# Altium project XC Tail Light Driver.PrjPcb
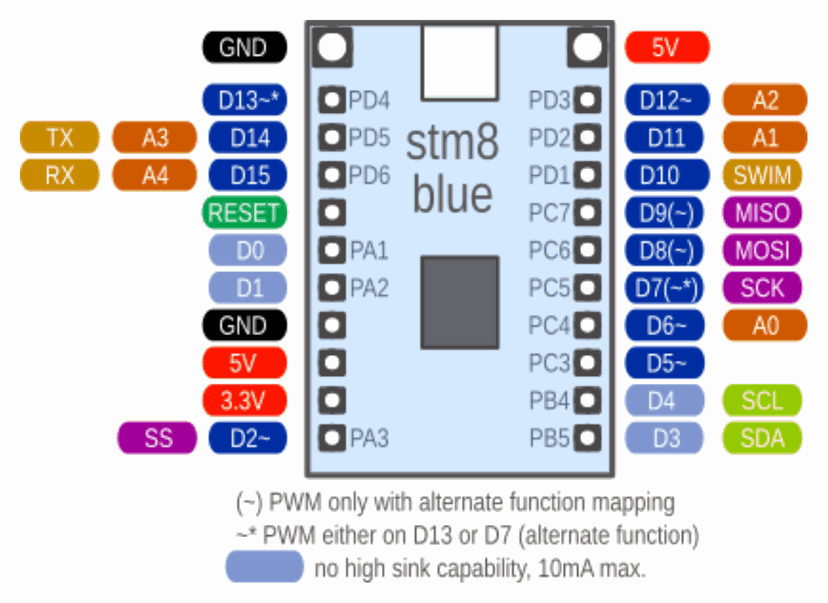
[diagram p0: XC STM8.SchDoc]
7 sheets, 103 parts. Net scope: global (net labels, ports and power ports of the same name join across sheets).
Board file: XC Driver Board.PcbDoc
Sheets:
  XC STM8.SchDoc
  XC Tail Light Driver.SchDoc
  PWM Drivers.SchDoc
  Power Supplies.SchDoc
  Signals.SchDoc
  ESP-WROOM-32 38 PIN Develeopment Board PINOUT.SchDoc
  ESP32.SchDoc

## Sheet XC STM8.SchDoc
size A4

## Sheet XC Tail Light Driver.SchDoc
size A4
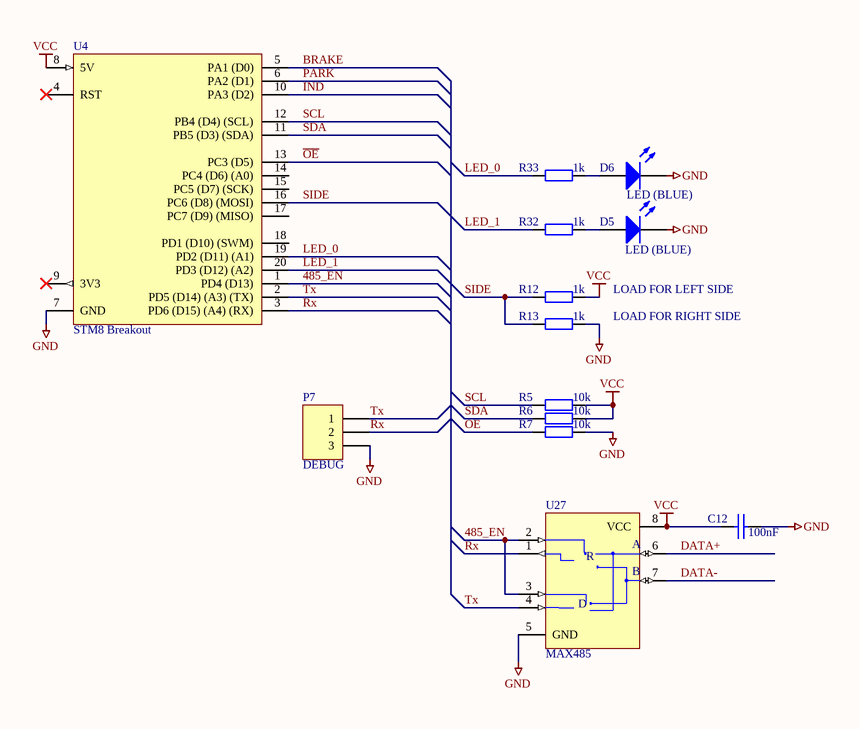
[diagram p1: XC Tail Light Driver.SchDoc]

### Parts
C12  100nF  [CAPACITOR 0805]
D5  LED (BLUE)  [LED(3D) 3MM VERTICAL (GREEN)]
D6  LED (BLUE)  [LED(3D) 3MM VERTICAL (GREEN)]
P7  DEBUG  [Pin Header 1x3 TH Pitch 2.54mm]
R5  10k  [RESISTOR 0805]
R6  10k  [RESISTOR 0805]
R7  10k  [RESISTOR 0805]
R12  1k  [RESISTOR 0805]
R13  1k  [RESISTOR 0805]
R32  1k  [RESISTOR 0805]
R33  1k  [RESISTOR 0805]
U4  STM8 Breakout  [STM8 Breakout]
U27  MAX485  [SO-8]

### Nets
GND: C12.2 D5.2(K) D6.2(K) P7.3 R7.1 R13.1 U4.7(GND) U27.5(GND)
VCC: C12.1 R5.1 R6.1 R12.1 U4.8(5V) U27.8(VCC)
485_EN: U4.1(PD4_(D13)) U27.2(~{RE}) U27.3(DE)
BRAKE: U4.5(PA1_(D0))
DATA+: U27.6(A)
DATA-: U27.7(B)
IND: U4.10(PA3_(D2))
LED_0: R33.2 U4.19(PD2_(D11)_(A1))
LED_1: R32.2 U4.20(PD3_(D12)_(A2))
~{OE}: R7.2 U4.13(PC3_(D5))
PARK: U4.6(PA2_(D1))
Rx: P7.2 U4.3(PD6_(D15)_(A4)_(RX)) U27.1(RO)
SCL: R5.2 U4.12(PB4_(D4)_(SCL))
SDA: R6.2 U4.11(PB5_(D3)_(SDA))
SIDE: R12.2 R13.2 U4.16(PC6_(D8)_(MOSI))
Tx: P7.1 U4.2(PD5_(D14)_(A3)_(TX)) U27.4(DI)
NetD5_1: D5.1(A) R32.1
NetD6_1: D6.1(A) R33.1

Not connected (* = marked no-connect by the designer): U4 4(RST)* 9(3V3)* 14(PC4_(D6)_(A0)) 15(PC5_(D7)_(SCK)) 17(PC7_(D9)_(MISO)) 18(PD1_(D10)_(SWM))

### Notes on the sheet
- LOAD FOR LEFT SIDE
- LOAD FOR RIGHT SIDE
- (in symbol MAX487CPA) R; D

### Library data of the parts
C12 = CAP: CAPACITOR SMD 0603; Manufacturer: Murata; Manufacturer Part No.: GCM188R71C104KA37D; value: 100nF; Mouser Part no.: 81-GCM188R71C104KA7D; Web link: http://au.mouser.com/ProductDetail/Murata/GCM188R71C104KA37D/?qs=aEuGZpxfbxWKAxwYn%252beTMg%3d%3d
D5 D6 = LED 3mm RED: 3mm RED LED; Manufacturer: Kingbright; Manufacturer Part No.: WP132XIT; Mouser Part no.: 604-WP132XIT; Farnell Part no.: 1003393; Web link: http://au.mouser.com/Search/Refine.aspx?Keyword=604-WP132XIT
P7 = Header 3: Header, 3 Pin; Manufacturer: FCI; Manufacturer Part No.: 68020-102; Mouser Part no.: 649-68020-102; Web link: http://au.mouser.com/ProductDetail/FCI/68020-102/?qs=sGAEpiMZZMs%252bGHln7q6pm44kDepmYTI87r6%2fnQtKGLI%3d
R5-R7 R12 R13 R32 R33 = Res2: Resistor; Published: 8-Jun-2000; LatestRevisionDate: 17-Jul-2002; LatestRevisionNote: Re-released for DXP Platform.; PackageReference: AXIAL-0.4; Publisher: Altium Limited; PackageDescription: Axial Device, Thru-Hole; 2 Leads; 0.4 in Pin Spacing
  R5-R7: Value: 10k
  R12 R13 R32 R33: Value: 1k
U27 = MAX487CPA: MAX485 485/422 Transceiver; LCSC Part Number: C9945

## Sheet PWM Drivers.SchDoc
size A3
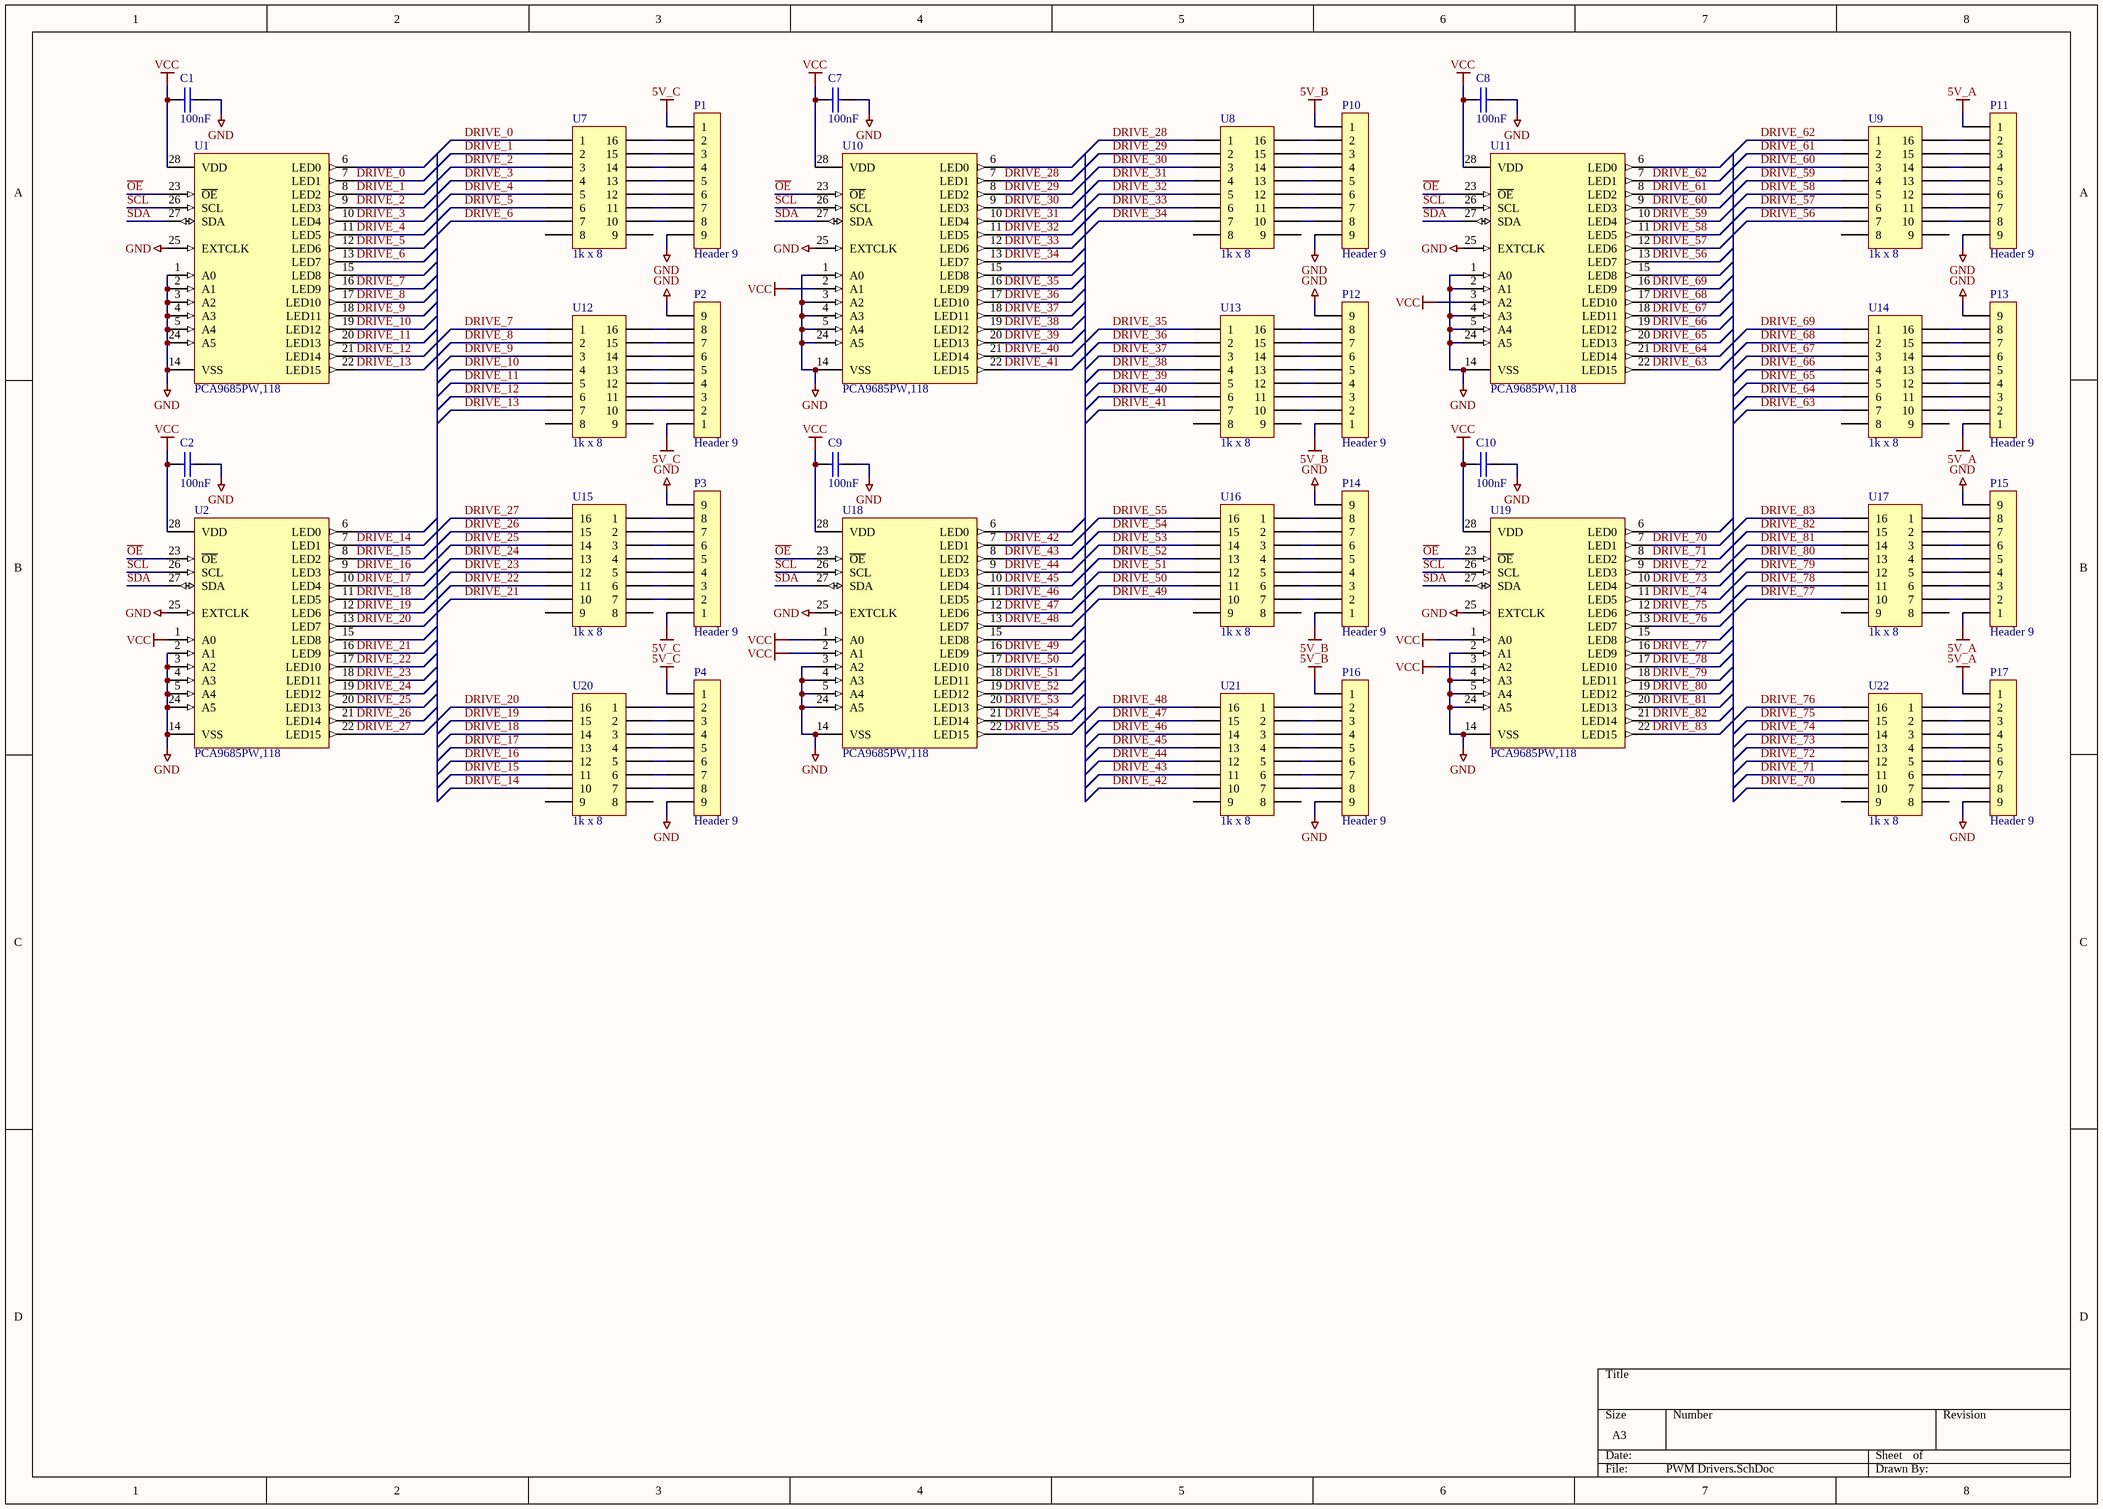
[diagram p2: PWM Drivers.SchDoc]

### Parts
C1  100nF  [CAPACITOR 0805]
C2  100nF  [CAPACITOR 0805]
C7  100nF  [CAPACITOR 0805]
C8  100nF  [CAPACITOR 0805]
C9  100nF  [CAPACITOR 0805]
C10  100nF  [CAPACITOR 0805]
P1  Header 9  [SOCKET 1x9]
P2  Header 9  [SOCKET 1x9]
P3  Header 9  [SOCKET 1x9]
P4  Header 9  [SOCKET 1x9]
P10  Header 9  [SOCKET 1x9]
P11  Header 9  [SOCKET 1x9]
P12  Header 9  [SOCKET 1x9]
P13  Header 9  [SOCKET 1x9]
P14  Header 9  [SOCKET 1x9]
P15  Header 9  [SOCKET 1x9]
P16  Header 9  [SOCKET 1x9]
P17  Header 9  [SOCKET 1x9]
U1  PCA9685PW,118  [SSOP28]
U2  PCA9685PW,118  [SSOP28]
U7  1k x 8  [DIP 16]
U8  1k x 8  [DIP 16]
U9  1k x 8  [DIP 16]
U10  PCA9685PW,118  [SSOP28]
U11  PCA9685PW,118  [SSOP28]
U12  1k x 8  [DIP 16]
U13  1k x 8  [DIP 16]
U14  1k x 8  [DIP 16]
U15  1k x 8  [DIP 16]
U16  1k x 8  [DIP 16]
U17  1k x 8  [DIP 16]
U18  PCA9685PW,118  [SSOP28]
U19  PCA9685PW,118  [SSOP28]
U20  1k x 8  [DIP 16]
U21  1k x 8  [DIP 16]
U22  1k x 8  [DIP 16]

### Nets
5V_A: P11.1 P13.1 P15.1 P17.1
5V_B: P10.1 P12.1 P14.1 P16.1
5V_C: P1.1 P2.1 P3.1 P4.1
GND: C1.2 C2.2 C7.2 C8.2 C9.2 C10.2 P1.9 P2.9 P3.9 P4.9 P10.9 P11.9 P12.9 P13.9 P14.9 P15.9 P16.9 P17.9 U1.1(A0) U1.2(A1) U1.3(A2) U1.4(A3) U1.5(A4) U1.14(VSS) U1.24(A5) U1.25(EXTCLK) U2.2(A1) U2.3(A2) U2.4(A3) U2.5(A4) U2.14(VSS) U2.24(A5) U2.25(EXTCLK) U10.1(A0) U10.3(A2) U10.4(A3) U10.5(A4) U10.14(VSS) U10.24(A5) U10.25(EXTCLK) U11.1(A0) U11.2(A1) U11.4(A3) U11.5(A4) U11.14(VSS) U11.24(A5) U11.25(EXTCLK) U18.3(A2) U18.4(A3) U18.5(A4) U18.14(VSS) U18.24(A5) U18.25(EXTCLK) U19.2(A1) U19.4(A3) U19.5(A4) U19.14(VSS) U19.24(A5) U19.25(EXTCLK)
VCC: C1.1 C2.1 C7.1 C8.1 C9.1 C10.1 U1.28(VDD) U2.1(A0) U2.28(VDD) U10.2(A1) U10.28(VDD) U11.3(A2) U11.28(VDD) U18.1(A0) U18.2(A1) U18.28(VDD) U19.1(A0) U19.3(A2) U19.28(VDD)
DRIVE_0: U1.7(LED1) U7.1
DRIVE_1: U1.8(LED2) U7.2
DRIVE_2: U1.9(LED3) U7.3
DRIVE_3: U1.10(LED4) U7.4
DRIVE_4: U1.11(LED5) U7.5
DRIVE_5: U1.12(LED6) U7.6
DRIVE_6: U1.13(LED7) U7.7
DRIVE_7: U1.16(LED9) U12.1
DRIVE_8: U1.17(LED10) U12.2
DRIVE_9: U1.18(LED11) U12.3
DRIVE_10: U1.19(LED12) U12.4
DRIVE_11: U1.20(LED13) U12.5
DRIVE_12: U1.21(LED14) U12.6
DRIVE_13: U1.22(LED15) U12.7
DRIVE_14: U2.7(LED1) U20.10
DRIVE_15: U2.8(LED2) U20.11
DRIVE_16: U2.9(LED3) U20.12
DRIVE_17: U2.10(LED4) U20.13
DRIVE_18: U2.11(LED5) U20.14
DRIVE_19: U2.12(LED6) U20.15
DRIVE_20: U2.13(LED7) U20.16
DRIVE_21: U2.16(LED9) U15.10
DRIVE_22: U2.17(LED10) U15.11
DRIVE_23: U2.18(LED11) U15.12
DRIVE_24: U2.19(LED12) U15.13
DRIVE_25: U2.20(LED13) U15.14
DRIVE_26: U2.21(LED14) U15.15
DRIVE_27: U2.22(LED15) U15.16
DRIVE_28: U8.1 U10.7(LED1)
DRIVE_29: U8.2 U10.8(LED2)
DRIVE_30: U8.3 U10.9(LED3)
DRIVE_31: U8.4 U10.10(LED4)
DRIVE_32: U8.5 U10.11(LED5)
DRIVE_33: U8.6 U10.12(LED6)
DRIVE_34: U8.7 U10.13(LED7)
DRIVE_35: U10.16(LED9) U13.1
DRIVE_36: U10.17(LED10) U13.2
DRIVE_37: U10.18(LED11) U13.3
DRIVE_38: U10.19(LED12) U13.4
DRIVE_39: U10.20(LED13) U13.5
DRIVE_40: U10.21(LED14) U13.6
DRIVE_41: U10.22(LED15) U13.7
DRIVE_42: U18.7(LED1) U21.10
DRIVE_43: U18.8(LED2) U21.11
DRIVE_44: U18.9(LED3) U21.12
DRIVE_45: U18.10(LED4) U21.13
DRIVE_46: U18.11(LED5) U21.14
DRIVE_47: U18.12(LED6) U21.15
DRIVE_48: U18.13(LED7) U21.16
DRIVE_49: U16.10 U18.16(LED9)
DRIVE_50: U16.11 U18.17(LED10)
DRIVE_51: U16.12 U18.18(LED11)
DRIVE_52: U16.13 U18.19(LED12)
DRIVE_53: U16.14 U18.20(LED13)
DRIVE_54: U16.15 U18.21(LED14)
DRIVE_55: U16.16 U18.22(LED15)
DRIVE_56: U9.7 U11.13(LED7)
DRIVE_57: U9.6 U11.12(LED6)
DRIVE_58: U9.5 U11.11(LED5)
DRIVE_59: U9.4 U11.10(LED4)
DRIVE_60: U9.3 U11.9(LED3)
DRIVE_61: U9.2 U11.8(LED2)
DRIVE_62: U9.1 U11.7(LED1)
DRIVE_63: U11.22(LED15) U14.7
DRIVE_64: U11.21(LED14) U14.6
DRIVE_65: U11.20(LED13) U14.5
DRIVE_66: U11.19(LED12) U14.4
DRIVE_67: U11.18(LED11) U14.3
DRIVE_68: U11.17(LED10) U14.2
DRIVE_69: U11.16(LED9) U14.1
DRIVE_70: U19.7(LED1) U22.10
DRIVE_71: U19.8(LED2) U22.11
DRIVE_72: U19.9(LED3) U22.12
DRIVE_73: U19.10(LED4) U22.13
DRIVE_74: U19.11(LED5) U22.14
DRIVE_75: U19.12(LED6) U22.15
DRIVE_76: U19.13(LED7) U22.16
DRIVE_77: U17.10 U19.16(LED9)
DRIVE_78: U17.11 U19.17(LED10)
DRIVE_79: U17.12 U19.18(LED11)
DRIVE_80: U17.13 U19.19(LED12)
DRIVE_81: U17.14 U19.20(LED13)
DRIVE_82: U17.15 U19.21(LED14)
DRIVE_83: U17.16 U19.22(LED15)
~{OE}: U1.23(~{OE}) U2.23(~{OE}) U10.23(~{OE}) U11.23(~{OE}) U18.23(~{OE}) U19.23(~{OE})
SCL: U1.26(SCL) U2.26(SCL) U10.26(SCL) U11.26(SCL) U18.26(SCL) U19.26(SCL)
SDA: U1.27(SDA) U2.27(SDA) U10.27(SDA) U11.27(SDA) U18.27(SDA) U19.27(SDA)
NetP1_2: P1.2 U7.16
NetP1_3: P1.3 U7.15
NetP1_4: P1.4 U7.14
NetP1_5: P1.5 U7.13
NetP1_6: P1.6 U7.12
NetP1_7: P1.7 U7.11
NetP1_8: P1.8 U7.10
NetP2_2: P2.2 U12.10
NetP2_3: P2.3 U12.11
NetP2_4: P2.4 U12.12
NetP2_5: P2.5 U12.13
NetP2_6: P2.6 U12.14
NetP2_7: P2.7 U12.15
NetP2_8: P2.8 U12.16
NetP3_2: P3.2 U15.7
NetP3_3: P3.3 U15.6
NetP3_4: P3.4 U15.5
NetP3_5: P3.5 U15.4
NetP3_6: P3.6 U15.3
NetP3_7: P3.7 U15.2
NetP3_8: P3.8 U15.1
NetP4_2: P4.2 U20.1
NetP4_3: P4.3 U20.2
NetP4_4: P4.4 U20.3
NetP4_5: P4.5 U20.4
NetP4_6: P4.6 U20.5
NetP4_7: P4.7 U20.6
NetP4_8: P4.8 U20.7
NetP10_2: P10.2 U8.16
NetP10_3: P10.3 U8.15
NetP10_4: P10.4 U8.14
NetP10_5: P10.5 U8.13
NetP10_6: P10.6 U8.12
NetP10_7: P10.7 U8.11
NetP10_8: P10.8 U8.10
NetP11_2: P11.2 U9.16
NetP11_3: P11.3 U9.15
NetP11_4: P11.4 U9.14
NetP11_5: P11.5 U9.13
NetP11_6: P11.6 U9.12
NetP11_7: P11.7 U9.11
NetP11_8: P11.8 U9.10
NetP12_2: P12.2 U13.10
NetP12_3: P12.3 U13.11
NetP12_4: P12.4 U13.12
NetP12_5: P12.5 U13.13
NetP12_6: P12.6 U13.14
NetP12_7: P12.7 U13.15
NetP12_8: P12.8 U13.16
NetP13_2: P13.2 U14.10
NetP13_3: P13.3 U14.11
NetP13_4: P13.4 U14.12
NetP13_5: P13.5 U14.13
NetP13_6: P13.6 U14.14
NetP13_7: P13.7 U14.15
NetP13_8: P13.8 U14.16
NetP14_2: P14.2 U16.7
NetP14_3: P14.3 U16.6
NetP14_4: P14.4 U16.5
NetP14_5: P14.5 U16.4
NetP14_6: P14.6 U16.3
NetP14_7: P14.7 U16.2
NetP14_8: P14.8 U16.1
NetP15_2: P15.2 U17.7
NetP15_3: P15.3 U17.6
NetP15_4: P15.4 U17.5
NetP15_5: P15.5 U17.4
NetP15_6: P15.6 U17.3
NetP15_7: P15.7 U17.2
NetP15_8: P15.8 U17.1
NetP16_2: P16.2 U21.1
NetP16_3: P16.3 U21.2
NetP16_4: P16.4 U21.3
NetP16_5: P16.5 U21.4
NetP16_6: P16.6 U21.5
NetP16_7: P16.7 U21.6
NetP16_8: P16.8 U21.7
NetP17_2: P17.2 U22.1
NetP17_3: P17.3 U22.2
NetP17_4: P17.4 U22.3
NetP17_5: P17.5 U22.4
NetP17_6: P17.6 U22.5
NetP17_7: P17.7 U22.6
NetP17_8: P17.8 U22.7

Not connected (* = marked no-connect by the designer): U1 6(LED0) 15(LED8); U2 6(LED0) 15(LED8); U7 8 9; U8 8 9; U9 8 9; U10 6(LED0) 15(LED8); U11 6(LED0) 15(LED8); U12 8 9; U13 8 9; U14 8 9; U15 8 9; U16 8 9; U17 8 9; U18 6(LED0) 15(LED8); U19 6(LED0) 15(LED8); U20 8 9; U21 8 9; U22 8 9

### Library data of the parts
C1 C2 C7-C10 = CAP: as C12 on sheet XC Tail Light Driver; value: 100nF; Mouser Part no.: 81-GCM188R71C104KA7D; Web link: http://au.mouser.com/ProductDetail/Murata/GCM188R71C104KA37D/?qs=aEuGZpxfbxWKAxwYn%252beTMg%3d%3d
P1-P4 P10-P17 = Header 9: Header, 9-Pin; LatestRevisionDate: 17-Jul-2002; LatestRevisionNote: Re-released for DXP Platform.; Publisher: Altium Limited
U1 U2 U10 U11 U18 U19 = PCA9685PW,118: LED Driver IC 16 Output Linear PWM Dimming 25mA 28-TSSOP; MF: NXP USA; Package: TSSOP-28 NXP Semiconductors; MP: PCA9685PW,118; Value: *; SnapEDA_Link: https://www.snapeda.com/parts/PCA9685PW%2C118/NXP%20USA%20Inc./view-part/1041520/?ref=snap; Digi-Key_Purchase_URL: https://www.digikey.in/product-detail/en/nxp-usa-inc/PCA9685PW,118/568-11925-1-ND/5221902?utm_source=snapeda&utm_medium=aggregator&utm_campaign=symbol; Digi-Key_Part_Number: 568-11925-1-ND
U7-U9 U12-U17 U20-U22 = ResistorArray: DIP 16 Resistor Array 8 x 1k; Value: 1k x 8; LCSC Part Number: C1525823

## Sheet Power Supplies.SchDoc
size A4
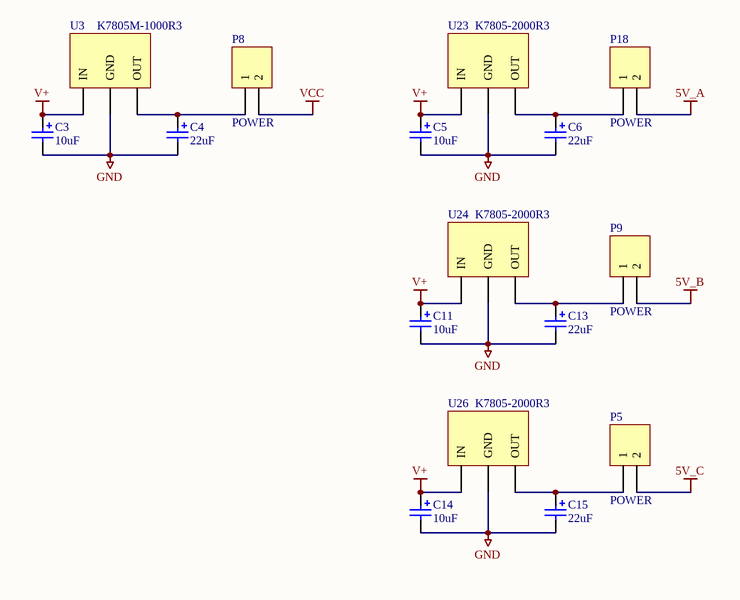
[diagram p3: Power Supplies.SchDoc]

### Parts
C3  10uF  [CAPACITOR 6.3x7]
C4  22uF  [CAPACITOR 5x11]
C5  10uF  [CAPACITOR 6.3x7]
C6  22uF  [CAPACITOR 5x11]
C11  10uF  [CAPACITOR 6.3x7]
C13  22uF  [CAPACITOR 5x11]
C14  10uF  [CAPACITOR 6.3x7]
C15  22uF  [CAPACITOR 5x11]
P5  POWER  [HEADER 1x2]
P8  POWER  [HEADER 1x2]
P9  POWER  [HEADER 1x2]
P18  POWER  [HEADER 1x2]
U3  K7805M-1000R3  [K78xxM-1000R3]
U23  K7805-2000R3  [K78xxM-1000R3L]
U24  K7805-2000R3  [K78xxM-1000R3L]
U26  K7805-2000R3  [K78xxM-1000R3L]

### Nets
5V_A: P18.2
5V_B: P9.2
5V_C: P5.2
GND: C3.2 C4.2 C5.2 C6.2 C11.2 C13.2 C14.2 C15.2 U3.2(GND) U23.2(GND) U24.2(GND) U26.2(GND)
V+: C3.1 C5.1 C11.1 C14.1 U3.1(IN) U23.1(IN) U24.1(IN) U26.1(IN)
VCC: P8.2
NetC4_1: C4.1 P8.1 U3.3(OUT)
NetC6_1: C6.1 P18.1 U23.3(OUT)
NetC13_1: C13.1 P9.1 U24.3(OUT)
NetC15_1: C15.1 P5.1 U26.3(OUT)

### Library data of the parts
C3-C6 C11 C13-C15 = Aluminum 10Dx16Hx5P: Polarized Capacitor (Radial)
  C3 C5 C11 C14: LCSC Part Number: C160183; Value: 10uF
  C4 C6 C13 C15: LCSC Part Number: C512951; Value: 22uF
P5 P8 P9 P18 = Header 2: Header, 2-Pin; LatestRevisionDate: 17-Jul-2002; LatestRevisionNote: Re-released for DXP Platform.; Publisher: Altium Limited
U3 = TRACO 1-2450: RS_PRO K7805M-1000R3; Value: K7805M-1000R3; Supplier: RS-COMPONENTS; Supplier Part Number: 193-4004
U23 U24 U26 = TRACO 1-2450: RS_PRO K7805-2000R3L; Value: K7805-2000R3; Supplier: RS-COMPONENTS; Supplier Part Number: 193-4032

## Sheet Signals.SchDoc
size A4
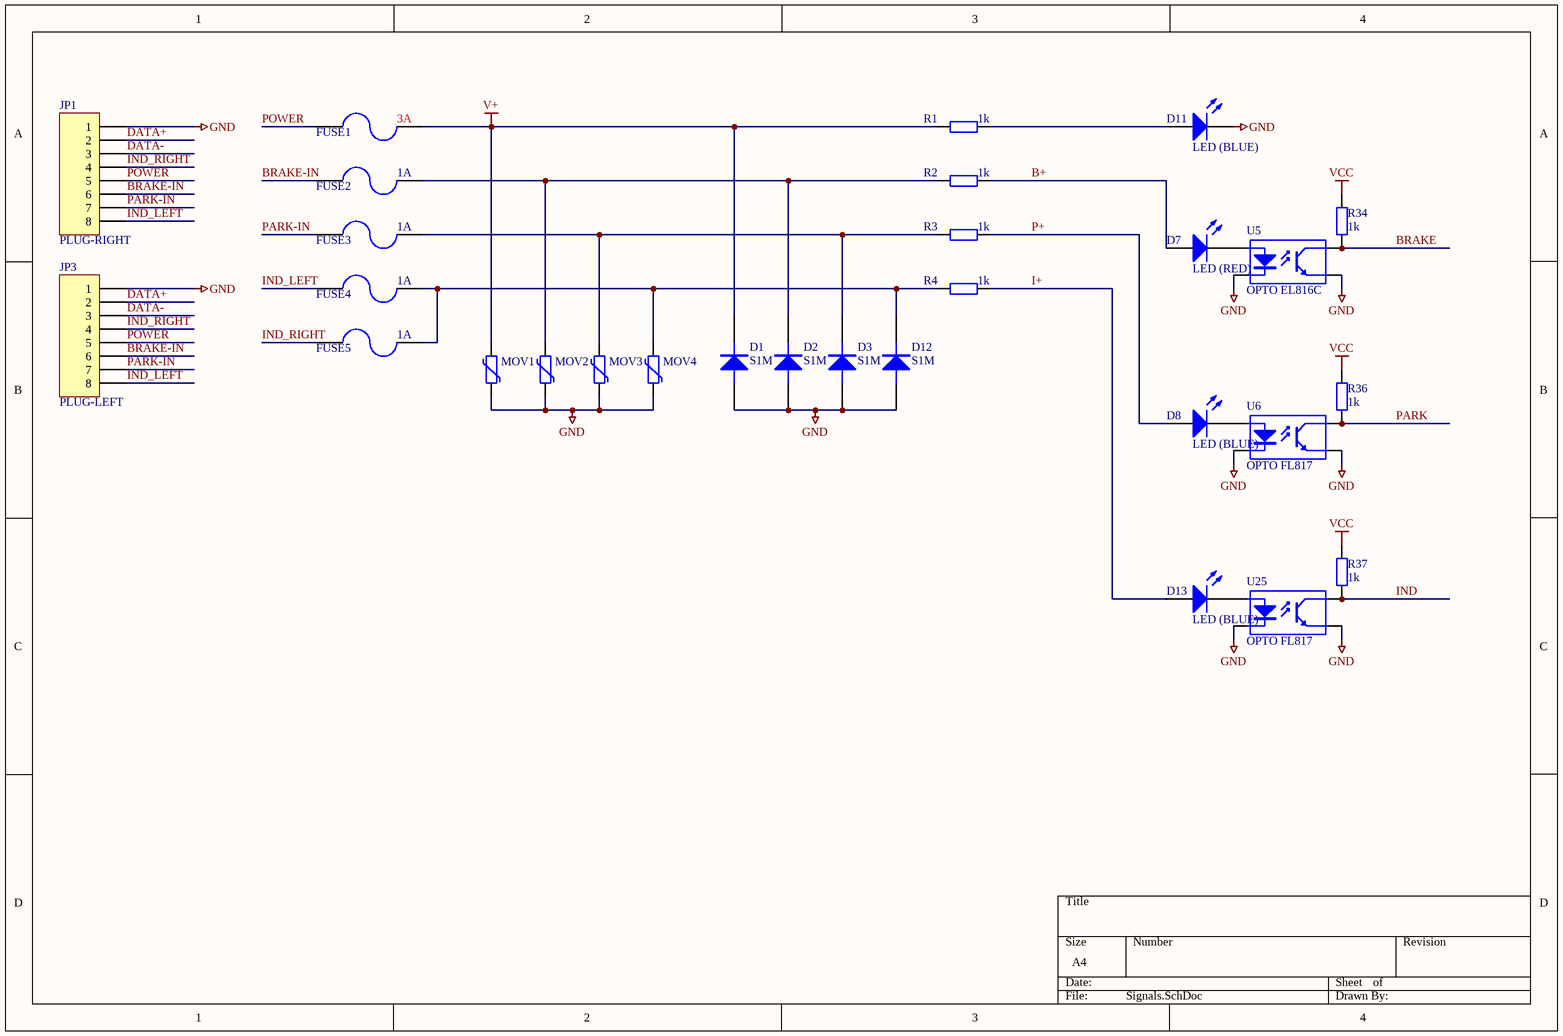
[diagram p4: Signals.SchDoc]

### Parts
D1  S1M  [DO-214AC]
D2  S1M  [DO-214AC]
D3  S1M  [DO-214AC]
D7  LED (RED)  [LED(3D) 3MM VERTICAL (GREEN)]
D8  LED (BLUE)  [LED(3D) 3MM VERTICAL (GREEN)]
D11  LED (BLUE)  [LED(3D) 3MM VERTICAL (GREEN)]
D12  S1M  [DO-214AC]
D13  LED (BLUE)  [LED(3D) 3MM VERTICAL (GREEN)]
FUSE1  3A  [miniSMD Polyswitch]
FUSE2  1A  [miniSMD Polyswitch]
FUSE3  1A  [miniSMD Polyswitch]
FUSE4  1A  [miniSMD Polyswitch]
FUSE5  1A  [miniSMD Polyswitch]
JP1  PLUG-RIGHT  [Molex 26013144 RA 8P Socket]
JP3  PLUG-LEFT  [Molex 26013144 RA 8P Socket]
MOV1  FTR FTR07D270K 22V  [MOV - 10mm]  (value not drawn)
MOV2  FTR FTR07D270K 22V  [MOV - 10mm]  (value not drawn)
MOV3  FTR FTR07D270K 22V  [MOV - 10mm]  (value not drawn)
MOV4  FTR FTR07D270K 22V  [MOV - 10mm]  (value not drawn)
R1  1k  [RESISTOR 0805]
R2  1k  [RESISTOR 0805]
R3  1k  [RESISTOR 0805]
R4  1k  [RESISTOR 0805]
R34  1k  [RESISTOR 0805]
R36  1k  [RESISTOR 0805]
R37  1k  [RESISTOR 0805]
U5  OPTO EL816C  [DIP_4]
U6  OPTO FL817  [DIP_4]
U25  OPTO FL817  [DIP_4]

### Nets
GND: D1.1(A) D2.1(A) D3.1(A) D11.2(K) D12.1(A) JP1.1 JP3.1 MOV1.2 MOV2.2 MOV3.2 MOV4.2 U5.2(K) U5.3(E) U6.2(K) U6.3(E) U25.2(K) U25.3(E)
V+: D1.2(K) FUSE1.2 MOV1.1 R1.2
VCC: R34.1 R36.1 R37.1
B+: D7.1(A) R2.1
BRAKE: R34.2 U5.4(C)
BRAKE-IN: FUSE2.1 JP1.6 JP3.6
DATA+: JP1.2 JP3.2
DATA-: JP1.3 JP3.3
I+: D13.1(A) R4.1
IND: R37.2 U25.4(C)
IND_LEFT: FUSE4.1 JP1.8 JP3.8
IND_RIGHT: FUSE5.1 JP1.4 JP3.4
P+: D8.1(A) R3.1
PARK: R36.2 U6.4(C)
PARK-IN: FUSE3.1 JP1.7 JP3.7
POWER: FUSE1.1 JP1.5 JP3.5
NetD2_2: D2.2(K) FUSE2.2 MOV2.1 R2.2
NetD3_2: D3.2(K) FUSE3.2 MOV3.1 R3.2
NetD7_2: D7.2(K) U5.1(A)
NetD8_2: D8.2(K) U6.1(A)
NetD11_1: D11.1(A) R1.1
NetD12_2: D12.2(K) FUSE4.2 FUSE5.2 MOV4.1 R4.2
NetD13_2: D13.2(K) U25.1(A)

### Library data of the parts
D1-D3 D12 = DIODE: DIODE, POWER; Manufacturer: Taiwan Semiconductor; Mouser Part no.: 821-S1M; Manufacturer Part No.: S1M; value: S1M; Web link: http://au.mouser.com/ProductDetail/Taiwan-Semiconductor/S1M/?qs=sGAEpiMZZMtEwUVCuofpuOlSmRjzJonf%252bmrIm0%252bGbjE%3d
D7 D8 D11 D13 = LED 3mm RED: as D5 on sheet XC Tail Light Driver; Mouser Part no.: 604-WP132XIT; Farnell Part no.: 1003393; Web link: http://au.mouser.com/Search/Refine.aspx?Keyword=604-WP132XIT
FUSE1-FUSE5 = POLYSWITCH 500mA: POLYSWITCH 1A; Manufacturer: Tyco Electronics / Raychem; Manufacturer Part No.: MINISMDC050F-2; Mouser Part no.: 650-MINISMDC050F-2; Farnell Part no.: 1175839; Web link: http://au.mouser.com/ProductDetail/Tyco-Electronics-Raychem/MINISMDC050F-2/?qs=sGAEpiMZZMu7EFbsM1w0neRfX3mrvYIvOpkrchiUGng%3d
JP1 JP3 = Header 8: HEADER, 8 WAY; Value: MOLEX 26013144; Revision: July-2002: Re-released for DXP Platform.
MOV1-MOV4 = VARISTOR: Value: FTR FTR07D270K 22V
R1-R4 R34 R36 R37 = Res2: Resistor; Published: 8-Jun-2000; LatestRevisionDate: 17-Jul-2002; LatestRevisionNote: Re-released for DXP Platform.; PackageReference: AXIAL-0.4; Publisher: Altium Limited; PackageDescription: Axial Device, Thru-Hole; 2 Leads; 0.4 in Pin Spacing; Value: 1k
U5 U6 U25 = FL817: 4-Pin Phototransistor Optocoupler
  U5: LCSC Part Number: C181880

## Sheet ESP-WROOM-32 38 PIN Develeopment Board PINOUT.SchDoc
size A4

## Sheet ESP32.SchDoc
size A4
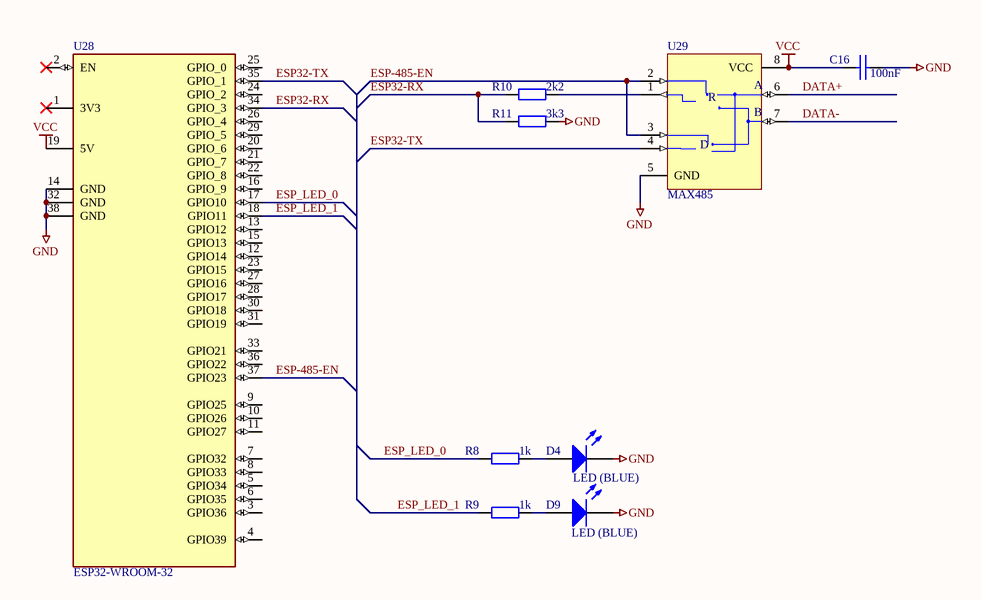
[diagram p5: ESP32.SchDoc]

### Parts
C16  100nF  [CAPACITOR 0805]
D4  LED (BLUE)  [LED(3D) 3MM VERTICAL (GREEN)]
D9  LED (BLUE)  [LED(3D) 3MM VERTICAL (GREEN)]
R8  1k  [RESISTOR 0805]
R9  1k  [RESISTOR 0805]
R10  2k2  [RESISTOR 0805]
R11  3k3  [RESISTOR 0805]
U28  ESP32-WROOM-32  [ESP-WROOM-32]
U29  MAX485  [SO-8]

### Nets
GND: C16.2 D4.2(K) D9.2(K) R11.1 U28.14(GND) U28.32(GND) U28.38(GND) U29.5(GND)
VCC: C16.1 U28.19(5V) U29.8(VCC)
DATA+: U29.6(A)
DATA-: U29.7(B)
ESP32-RX: R10.2 R11.2 U28.34(GPIO_3)
ESP32-TX: U28.35(GPIO_1) U29.4(DI)
ESP-485-EN: U28.37(GPIO23) U29.2(~{RE}) U29.3(DE)
ESP_LED_0: R8.2 U28.17(GPIO10)
ESP_LED_1: R9.2 U28.18(GPIO11)
NetD4_1: D4.1(A) R8.1
NetD9_1: D9.1(A) R9.1
NetR10_1: R10.1 U29.1(RO)

Not connected (* = marked no-connect by the designer): U28 1(3V3)* 2(EN)* 3(GPIO36) 4(GPIO39) 5(GPIO34) 6(GPIO35) 7(GPIO32) 8(GPIO33) 9(GPIO25) 10(GPIO26) 11(GPIO27) 12(GPIO14) 13(GPIO12) 15(GPIO13) 16(GPIO_9) 20(GPIO_6) 21(GPIO_7) 22(GPIO_8) 23(GPIO15) 24(GPIO_2) 25(GPIO_0) 26(GPIO_4) 27(GPIO16) 28(GPIO17) 29(GPIO_5) 30(GPIO18) 31(GPIO19) 33(GPIO21) 36(GPIO22)

### Notes on the sheet
- (in symbol MAX487CPA) R; D

### Library data of the parts
C16 = CAP: as C12 on sheet XC Tail Light Driver; value: 100nF; Mouser Part no.: 81-GCM188R71C104KA7D; Web link: http://au.mouser.com/ProductDetail/Murata/GCM188R71C104KA37D/?qs=aEuGZpxfbxWKAxwYn%252beTMg%3d%3d
D4 D9 = LED 3mm RED: as D5 on sheet XC Tail Light Driver; Mouser Part no.: 604-WP132XIT; Farnell Part no.: 1003393; Web link: http://au.mouser.com/Search/Refine.aspx?Keyword=604-WP132XIT
R8-R11 = Res2: Resistor; Published: 8-Jun-2000; LatestRevisionDate: 17-Jul-2002; LatestRevisionNote: Re-released for DXP Platform.; PackageReference: AXIAL-0.4; Publisher: Altium Limited; PackageDescription: Axial Device, Thru-Hole; 2 Leads; 0.4 in Pin Spacing
  R8 R9: Value: 1k
  R10: Value: 2k2
  R11: Value: 3k3
U28 = ESP-WROOM-32 38 PIN Develeopment Board PINOUT
U29 = MAX487CPA: MAX485 485/422 Transceiver; LCSC Part Number: C9945

## Nets that join several sheets
5V_A: PWM Drivers (P11.1 P13.1 P15.1 P17.1), Power Supplies (P18.2)
5V_B: PWM Drivers (P10.1 P12.1 P14.1 P16.1), Power Supplies (P9.2)
5V_C: PWM Drivers (P1.1 P2.1 P3.1 P4.1), Power Supplies (P5.2)
GND: XC Tail Light Driver (8 pins), PWM Drivers (59 pins), Power Supplies (12 pins), Signals (17 pins), ESP32 (8 pins)
V+: Power Supplies (8 pins), Signals (D1.2 FUSE1.2 MOV1.1 R1.2)
VCC: XC Tail Light Driver (6 pins), PWM Drivers (19 pins), Power Supplies (P8.2), Signals (R34.1 R36.1 R37.1), ESP32 (C16.1 U28.19 U29.8)
BRAKE: XC Tail Light Driver (U4.5), Signals (R34.2 U5.4)
DATA+: XC Tail Light Driver (U27.6), Signals (JP1.2 JP3.2), ESP32 (U29.6)
DATA-: XC Tail Light Driver (U27.7), Signals (JP1.3 JP3.3), ESP32 (U29.7)
IND: XC Tail Light Driver (U4.10), Signals (R37.2 U25.4)
~{OE}: XC Tail Light Driver (R7.2 U4.13), PWM Drivers (6 pins)
PARK: XC Tail Light Driver (U4.6), Signals (R36.2 U6.4)
SCL: XC Tail Light Driver (R5.2 U4.12), PWM Drivers (6 pins)
SDA: XC Tail Light Driver (R6.2 U4.11), PWM Drivers (6 pins)